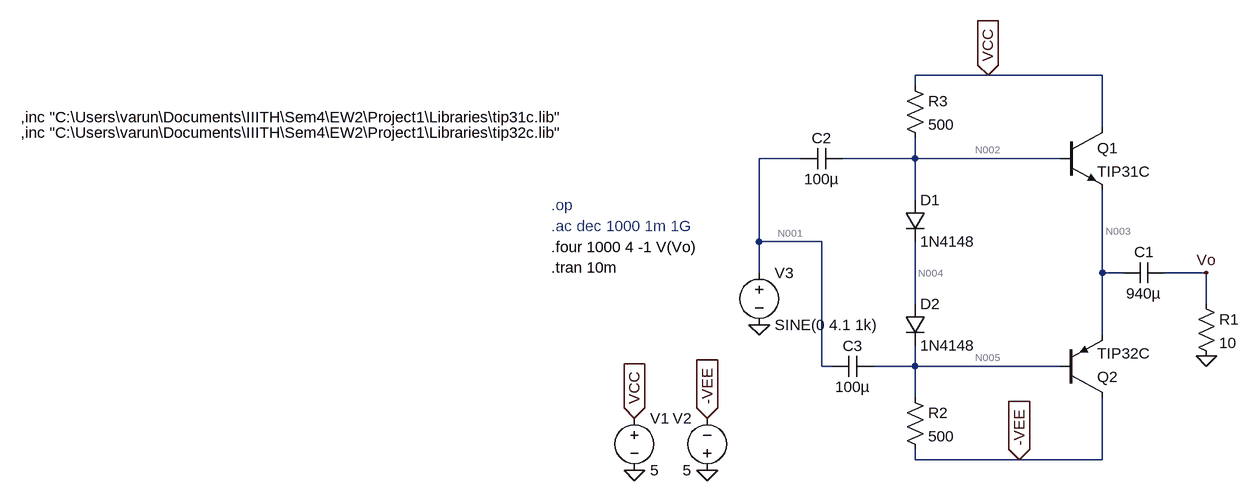
[diagram p0: schematic Poweramp_Stage.asc]
Poweramp_Stage.asc, the LTspice schematic file:
Version 4
SHEET 1 1236 680
WIRE 848 -128 736 -128
WIRE 1024 -128 848 -128
WIRE 736 -112 736 -128
WIRE 1024 -48 1024 -128
WIRE 560 0 496 0
WIRE 736 0 736 -32
WIRE 736 0 624 0
WIRE 960 0 736 0
WIRE 736 64 736 0
WIRE 496 128 496 0
WIRE 592 128 496 128
WIRE 496 176 496 128
WIRE 1024 176 1024 48
WIRE 1056 176 1024 176
WIRE 1184 176 1120 176
WIRE 736 224 736 128
WIRE 1184 224 1184 176
WIRE 1024 272 1024 176
WIRE 592 320 592 128
WIRE 608 320 592 320
WIRE 736 320 736 288
WIRE 736 320 672 320
WIRE 960 320 736 320
WIRE 736 368 736 320
WIRE 736 464 736 448
WIRE 896 464 736 464
WIRE 1024 464 1024 368
WIRE 1024 464 896 464
FLAG 1184 304 0
FLAG 1184 176 Vo
FLAG 416 480 0
FLAG 304 480 0
FLAG 304 400 VCC
IOPIN 304 400 In
FLAG 416 400 -VEE
IOPIN 416 400 In
FLAG 848 -128 VCC
IOPIN 848 -128 In
FLAG 896 464 -VEE
IOPIN 896 464 In
FLAG 496 256 0
SYMBOL diode 720 64 R0
SYMATTR InstName D1
SYMATTR Value 1N4148
SYMBOL diode 720 224 R0
SYMATTR InstName D2
SYMATTR Value 1N4148
SYMBOL npn 960 -48 R0
SYMATTR InstName Q1
SYMATTR Value TIP31C
SYMBOL pnp 960 368 M180
SYMATTR InstName Q2
SYMATTR Value TIP32C
SYMBOL res 1168 208 R0
SYMATTR InstName R1
SYMATTR Value 10
SYMBOL voltage 304 384 R0
SYMATTR InstName V1
SYMATTR Value 5
SYMBOL voltage 416 496 R180
WINDOW 0 24 96 Left 2
WINDOW 3 24 16 Left 2
SYMATTR InstName V2
SYMATTR Value 5
SYMBOL cap 1120 160 R90
WINDOW 0 0 32 VBottom 2
WINDOW 3 32 32 VTop 2
SYMATTR InstName C1
SYMATTR Value 940µ
SYMBOL voltage 496 160 R0
WINDOW 123 24 120 Left 2
WINDOW 39 0 0 Left 0
SYMATTR InstName V3
SYMATTR Value SINE(0 4.1 1k)
SYMBOL res 720 352 R0
SYMATTR InstName R2
SYMATTR Value 500
SYMBOL res 720 -128 R0
SYMATTR InstName R3
SYMATTR Value 500
SYMBOL cap 624 -16 R90
WINDOW 0 0 32 VBottom 2
WINDOW 3 32 32 VTop 2
SYMATTR InstName C2
SYMATTR Value 100µ
SYMBOL cap 672 304 R90
WINDOW 0 0 32 VBottom 2
WINDOW 3 32 32 VTop 2
SYMATTR InstName C3
SYMATTR Value 100µ
TEXT 176 168 Left 2 !.tran 10m
TEXT 176 104 Left 2 ;.ac dec 1000 1m 1G
TEXT 176 136 Left 2 !.four 1000 4 -1 V(Vo)
TEXT 176 72 Left 2 ;.op
TEXT -640 -40 Left 2 !,inc "C:\\Users\\varun\\Documents\\IIITH\\Sem4\\EW2\\Project1\\Libraries\\tip32c.lib"
TEXT -640 -64 Left 2 !,inc "C:\\Users\\varun\\Documents\\IIITH\\Sem4\\EW2\\Project1\\Libraries\\tip31c.lib"

The netlist it stands for:
* Poweramp_Stage.asc
D1 N002 N004 1N4148
D2 N004 N005 1N4148
Q1 VCC N002 N003 0 TIP31C
Q2 -VEE N005 N003 0 TIP32C
R1 Vo 0 10
V1 VCC 0 5
V2 0 -VEE 5
C1 Vo N003 940µ
V3 N001 0 SINE(0 4.1 1k)
R2 N005 -VEE 500
R3 VCC N002 500
C2 N002 N001 100µ
C3 N005 N001 100µ
.model D D
.lib standard.dio
.model NPN NPN
.model PNP PNP
.lib standard.bjt
.tran 10m
* .ac dec 1000 1m 1G
.four 1000 4 -1 V(Vo)
* .op
,inc "C:\Users\varun\Documents\IIITH\Sem4\EW2\Project1\Libraries\tip32c.lib"
,inc "C:\Users\varun\Documents\IIITH\Sem4\EW2\Project1\Libraries\tip31c.lib"
.backanno
.end

* Results of the author's LTspice run, read from the files saved beside the schematic
* Operating Point, zero values left out:
*   V(n002) = 686 mV
*   V(n004) = 4.483 mV
*   V(n005) = -677.1 mV
*   V(vcc) = 5 V
*   V(n003) = 56.01 mV
*   V(-vee) = -5 V
*   Ic(Q1) = 86.89 mA
*   Ib(Q1) = 849.3 µA
*   Ie(Q1) = -87.74 mA
*   Ic(Q2) = -86.87 mA
*   Ib(Q2) = -867.2 µA
*   Ie(Q2) = 87.74 mA
*   I(D1) = 7.779 mA
*   I(D2) = 7.779 mA
*   I(R2) = 8.646 mA
*   I(R3) = 8.628 mA
*   I(V1) = -95.52 mA
*   I(V2) = -95.52 mA
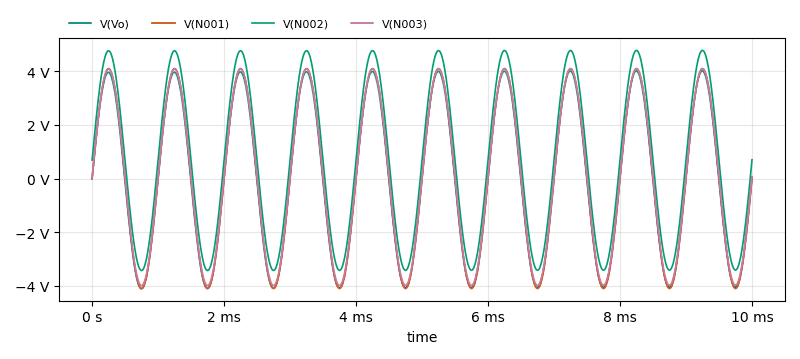
[diagram p1: Transient Analysis of Poweramp_Stage.asc, plotted from the saved traces]
* Transient Analysis, 1 run:
*   V(Vo): min -4.109 V, max 4.016 V, average -42.52 mV, rms 2.85 V, last 65.29 mV
*   V(N001): min -4.1 V, max 4.1 V, average 0 V, rms 2.899 V, last 0 V
*   V(N002): min -3.428 V, max 4.779 V, average 675.1 mV, rms 2.974 V, last 701.4 mV
*   V(N003): min -3.99 V, max 4.098 V, average 53.45 mV, rms 2.851 V, last 76.07 mV
* From the log:
*   N-Period=10.00
*   Fourier components of V(vo)
*   DC component:-0.0425206
*   Harmonic  Frequency   Fourier   Normalized   Phase    Normalized
*    Number     [Hz]     Component   Component  [degree]  Phase [deg]
*       1      1.000e+3   4.028e+0   1.000e+0     88.80°      0.00°
*       2      2.000e+3   2.161e-3   5.364e-4   -137.12°   -225.92°
*       3      3.000e+3   4.661e-3   1.157e-3    -99.45°   -188.25°
*       4      4.000e+3   6.440e-4   1.599e-4   -122.90°   -211.70°
*   Partial Harmonic Distortion: 0.128529%
*   Total Harmonic Distortion:   0.667175%